# Altium project 397881-L.PrjPcb
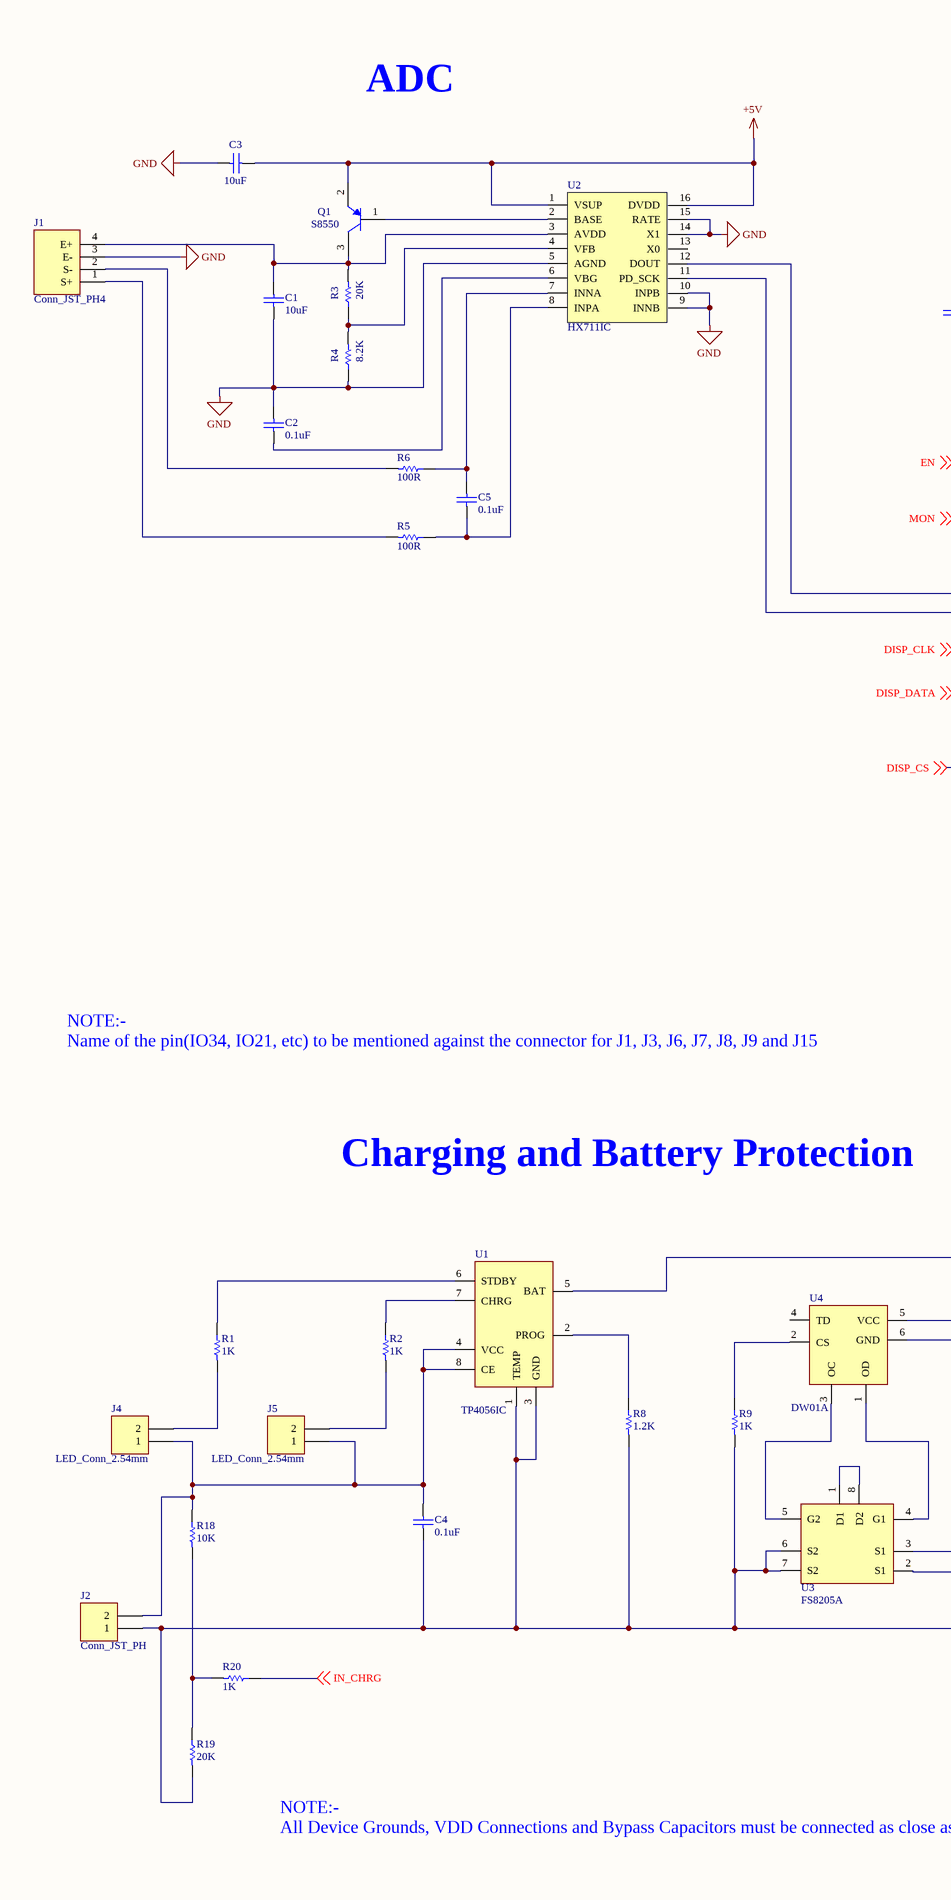
[diagram p0: 397881-L.SchDoc, left]
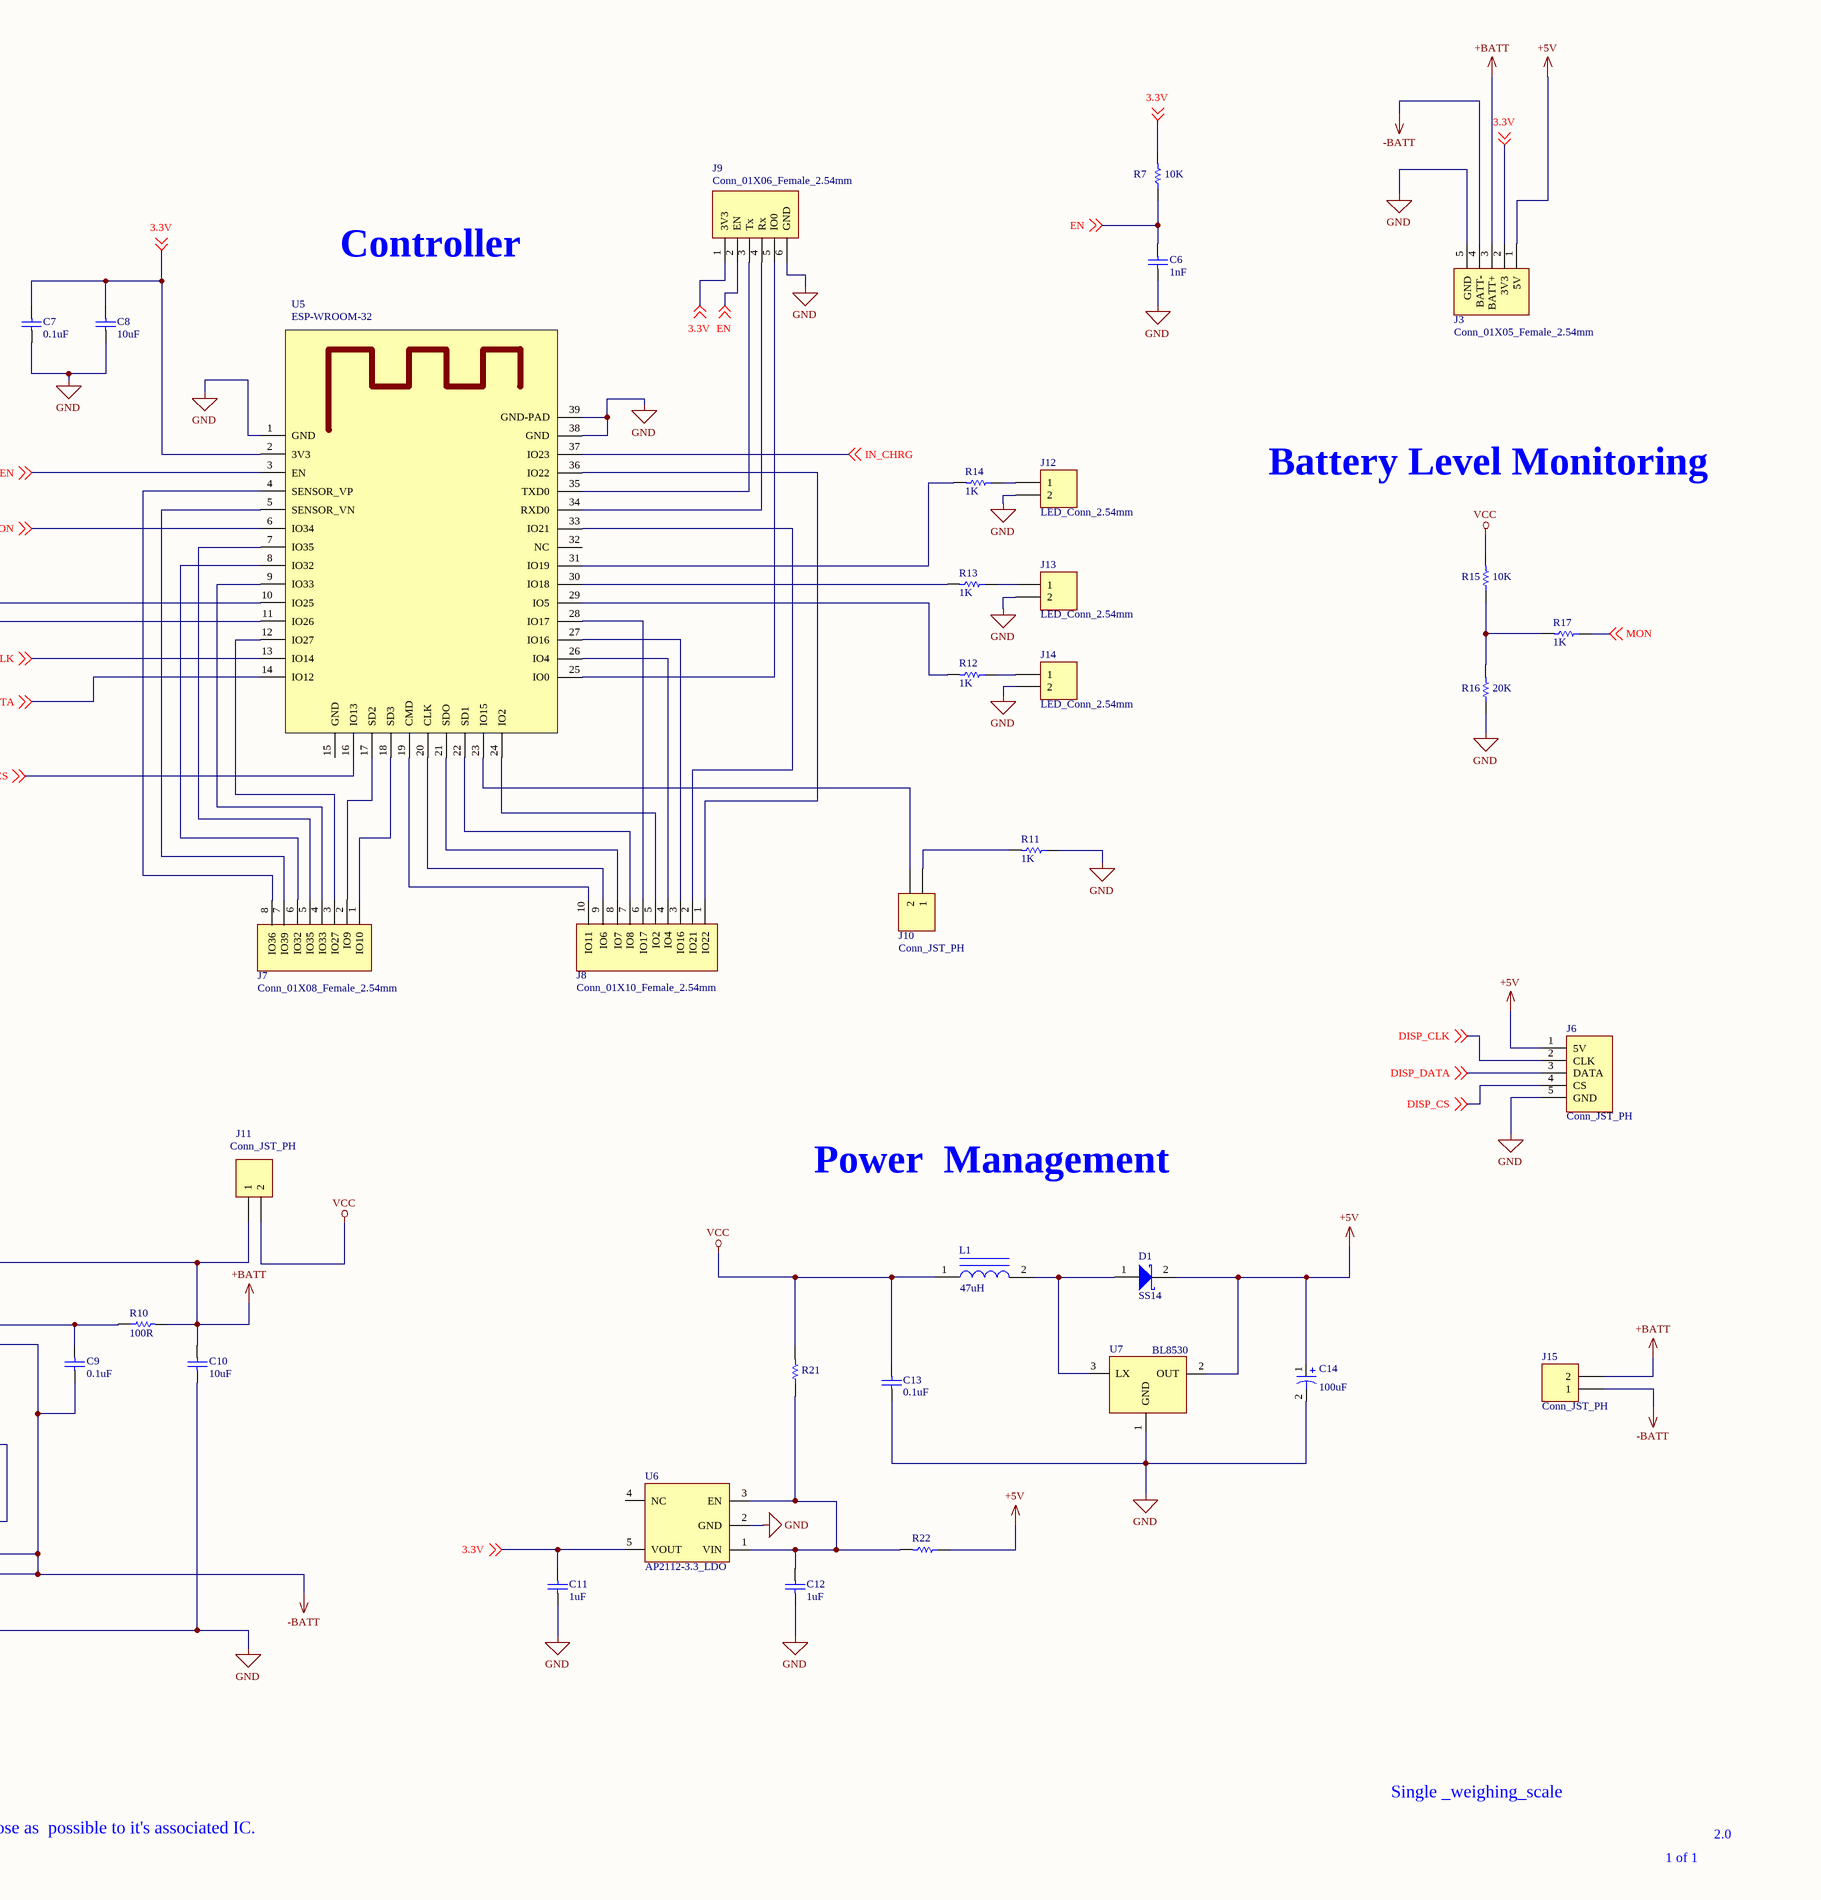
[diagram p1: 397881-L.SchDoc, right]
1 sheet, 61 parts. Net scope: global (net labels, ports and power ports of the same name join across sheets).
Board file: 397881-L.PcbDoc

## Sheet 397881-L.SchDoc
size A2

### Parts
C1  value 10uF  [C0603]  (hidden comment: Cap)
C2  value 0.1uF  [C0603]  (hidden comment: Cap)
C3  value 10uF  [C0603]  (hidden comment: Cap)
C4  value 0.1uF  [C0603]  (hidden comment: Cap)
C5  value 0.1uF  [C0603]  (hidden comment: Cap)
C6  value 1nF  [C0603]  (hidden comment: Cap)
C7  value 0.1uF  [C0603]  (hidden comment: Cap)
C8  value 10uF  [C0603]  (hidden comment: Cap)
C9  value 0.1uF  [C0603]  (hidden comment: Cap)
C10  value 10uF  [C0603]  (hidden comment: Cap)
C11  value 1uF  [C0603]  (hidden comment: Cap)
C12  value 1uF  [C0603]  (hidden comment: Cap)
C13  value 0.1uF  [C0603]  (hidden comment: Cap)
C14  value 100uF  [C14]  (hidden comment: Cap Pol1)
D1  SS14  [D1]
J1  Conn_JST_PH4  [J1]
J2  Conn_JST_PH  [J2,J10,J11,J15]
J3  Conn_01X05_Female_2.54mm  [J3]
J4  LED_Conn_2.54mm  [J4,J5,J12,J13,J14]
J5  LED_Conn_2.54mm  [J4,J5,J12,J13,J14]
J6  Conn_JST_PH  [J6]
J7  Conn_01X08_Female_2.54mm  [J7]
J8  Conn_01X10_Female_2.54mm  [J8]
J9  Conn_01X06_Female_2.54mm  [J9]
J10  Conn_JST_PH  [J2,J10,J11,J15]
J11  Conn_JST_PH  [J2,J10,J11,J15]
J12  LED_Conn_2.54mm  [J4,J5,J12,J13,J14]
J13  LED_Conn_2.54mm  [J4,J5,J12,J13,J14]
J14  LED_Conn_2.54mm  [J4,J5,J12,J13,J14]
J15  Conn_JST_PH  [J2,J10,J11,J15]
L1  value 47uH  [L1]  (hidden comment: Inductor Iron)
Q1  S8550  [Q1]
R1  value 1K  [R0603]  (hidden comment: Res1)
R2  value 1K  [R0603]  (hidden comment: Res1)
R3  value 20K  [R0603]  (hidden comment: Res1)
R4  value 8.2K  [R0603]  (hidden comment: Res1)
R5  value 100R  [R0603]  (hidden comment: Res1)
R6  value 100R  [R0603]  (hidden comment: Res1)
R7  value 10K  [R0603]  (hidden comment: Res1)
R8  value 1.2K  [R0603]  (hidden comment: Res1)
R9  value 1K  [R0603]  (hidden comment: Res1)
R10  value 100R  [R0603]  (hidden comment: Res1)
R11  value 1K  [R0603]  (hidden comment: Res1)
R12  value 1K  [R0603]  (hidden comment: Res1)
R13  value 1K  [R0603]  (hidden comment: Res1)
R14  value 1K  [R0603]  (hidden comment: Res1)
R15  value 10K  [R0603]  (hidden comment: Res1)
R16  value 20K  [R0603]  (hidden comment: Res1)
R17  value 1K  [R0603]  (hidden comment: Res1)
R18  value 10K  [R0603]  (hidden comment: Res1)
R19  value 20K  [R0603]  (hidden comment: Res1)
R20  value 1K  [R0603]  (hidden comment: Res1)
R21  Res1  [R0603]  (value not drawn)
R22  Res1  [R0603]  (value not drawn)
U1  TP4056IC  [U1]
U2  HX711IC
U3  FS8205A  [U3]
U4  DW01A  [U4]
U5  ESP-WROOM-32  [U5]
U6  AP2112-3.3_LDO  [U6]
U7  BL8530  [U7]

### Nets
+5V: C3.2 C14.1 D1.2(K) J3.1(5V) J6.1(5V) Q1.2(E) R22.1 U2.1(VSUP) U2.16(DVDD) U7.2(OUT)
+BATT: C10.2 J3.3(BATT+) J11.1 J15.2 R10.2 U1.5(BAT)
-BATT: C9.1 J3.4(BATT-) J15.1 U3.2(S1) U3.3(S1) U4.6(GND)
GND: C1.1 C2.2 C3.1 C4.1 C6.1 C7.1 C8.1 C10.1 C11.1 C12.1 C13.1 C14.2 J1.3(E-) J2.1 J3.5(GND) J6.5(GND) J9.6(GND) J12.2 J13.2 J14.2 R4.1 R8.2 R9.2 R11.1 R16.1 R19.2 U1.1(TEMP) U1.3(GND) U2.5(AGND) U2.9(INNB) U2.10(INPB) U2.14(X1) U2.15(RATE) U3.6(S2) U3.7(S2) U5.1(GND) U5.38(GND) U5.39(GND-PAD) U6.2(GND) U7.1(GND)
VCC: C13.2 J11.2 L1.1 R15.2 R21.2
3.3V: C7.2 C8.2 C11.2 J3.2(3V3) J9.1(3V3) R7.2 U5.2(3V3) U6.5(VOUT) ; off-sheet 3.3V
DISP_CLK: J6.2(CLK) U5.13(IO14) ; off-sheet DISP_CLK
DISP_CS: J6.4(CS) U5.16(IO13) ; off-sheet DISP_CS
DISP_DATA: J6.3(DATA) U5.14(IO12) ; off-sheet DISP_DATA
EN: C6.2 J9.2(EN) R7.1 U5.3(EN) ; off-sheet EN
IN_CHRG: R20.1 U5.37(IO23) ; off-sheet IN_CHRG
MON: R17.1 U5.6(IO34) ; off-sheet MON
NetC1_2: C1.2 J1.4(E+) Q1.3(C) R3.2 U2.3(AVDD)
NetC2_1: C2.1 U2.6(VBG)
NetC4_2: C4.2 J2.2 J4.1 J5.1 R18.1 U1.4(VCC) U1.8(CE)
NetC5_1: C5.1 R5.1 U2.8(INPA)
NetC5_2: C5.2 R6.1 U2.7(INNA)
NetC9_2: C9.2 R10.1 U4.5(VCC)
NetC12_2: C12.2 R21.1 R22.2 U6.1(VIN) U6.3(EN)
NetD1_1: D1.1(A) L1.2 U7.3(LX)
NetJ1_1: J1.1(S+) R5.2
NetJ1_2: J1.2(S-) R6.2
NetJ4_2: J4.2 R1.2
NetJ5_2: J5.2 R2.2
NetJ7_1: J7.1(IO10) U5.18(SD3)
NetJ7_2: J7.2(IO9) U5.17(SD2)
NetJ7_3: J7.3(IO27) U5.12(IO27)
NetJ7_4: J7.4(IO33) U5.9(IO33)
NetJ7_5: J7.5(IO35) U5.7(IO35)
NetJ7_6: J7.6(IO32) U5.8(IO32)
NetJ7_7: J7.7(IO39) U5.5(SENSOR_VN)
NetJ7_8: J7.8(IO36) U5.4(SENSOR_VP)
NetJ8_1: J8.1(IO22) U5.36(IO22)
NetJ8_2: J8.2(IO21) U5.33(IO21)
NetJ8_3: J8.3(IO16) U5.27(IO16)
NetJ8_4: J8.4(IO4) U5.26(IO4)
NetJ8_5: J8.5(IO2) U5.24(IO2)
NetJ8_6: J8.6(IO17) U5.28(IO17)
NetJ8_7: J8.7(IO8) U5.22(SD1)
NetJ8_8: J8.8(IO7) U5.21(SDO)
NetJ8_9: J8.9(IO6) U5.20(CLK)
NetJ8_10: J8.10(IO11) U5.19(CMD)
NetJ9_3: J9.3(Tx) U5.35(TXD0)
NetJ9_4: J9.4(Rx) U5.34(RXD0)
NetJ9_5: J9.5(IO0) U5.25(IO0)
NetJ10_1: J10.1 R11.2
NetJ10_2: J10.2 U5.23(IO15)
NetJ12_1: J12.1 R14.1
NetJ13_1: J13.1 R13.1
NetJ14_1: J14.1 R12.1
NetQ1_1: Q1.1(B) U2.2(BASE)
NetR1_1: R1.1 U1.6(STDBY)
NetR2_1: R2.1 U1.7(CHRG)
NetR3_1: R3.1 R4.2 U2.4(VFB)
NetR8_1: R8.1 U1.2(PROG)
NetR9_1: R9.1 U4.2(CS)
NetR12_2: R12.2 U5.29(IO5)
NetR13_2: R13.2 U5.30(IO18)
NetR14_2: R14.2 U5.31(IO19)
NetR15_1: R15.1 R16.2 R17.2
NetR18_2: R18.2 R19.1 R20.2
NetU2_11: U2.11(PD_SCK) U5.11(IO26)
NetU2_12: U2.12(DOUT) U5.10(IO25)
NetU3_1: U3.1(D1) U3.8(D2)
NetU3_4: U3.4(G1) U4.1(OD)
NetU3_5: U3.5(G2) U4.3(OC)

Not connected (* = marked no-connect by the designer): U2 13(X0); U4 4(TD); U5 15(GND) 32(NC); U6 4(NC)

### Notes on the sheet
- ADC
- Controller
- Battery Level Monitoring
- NOTE:-
- Name of the pin(IO34, IO21, etc) to be mentioned against the connector for J1, J3, J6, J7, J8, J9 and J15
- Charging and Battery Protection
- Power  Management
- Single _weighing_scale
- All Device Grounds, VDD Connections and Bypass Capacitors must be connected as close as  possible to it's associated IC.
- 1 of 1
- 2.0

### Library data of the parts
C1-C13 = Cap: Capacitor; Published: 8-Jun-2000; LatestRevisionDate: 17-Jul-2002; LatestRevisionNote: Re-released for DXP Platform.; PackageReference: RAD-0.3; Publisher: Altium Limited; PackageDescription: Radial Cap, Thru-Hole; 2 Leads; 0.3 in Pin Spacing
C14 = Cap Pol1: Polarized Capacitor (Radial); Published: 8-Jun-2000; LatestRevisionDate: 17-Jul-2002; LatestRevisionNote: Re-released for DXP Platform.; PackageReference: RB7.6-15; Publisher: Altium Limited; PackageDescription: Polarized Capacitor (Radial); 2 Leads
D1 = D Schottky: Schottky Diode; Published: 8-Jun-2000; LatestRevisionDate: 17-Jul-2002; LatestRevisionNote: Re-released for DXP Platform.; PackageReference: SMB; Publisher: Altium Limited; PackageDescription: DO-214-AA/SMB; 2 C-Bend Leads; Body 5.3 x 3.6 mm, inc. leads (LxW); Code_JEDEC: DO-214-AA
J1 = Conn_JST_PH4: Header, 5-Pin; LatestRevisionDate: 17-Jul-2002; LatestRevisionNote: Re-released for DXP Platform.; Publisher: Altium Limited
J2 J4 J5 J10-J15 = Header 2: Header, 2-Pin; LatestRevisionDate: 17-Jul-2002; LatestRevisionNote: Re-released for DXP Platform.; Publisher: Altium Limited
J3 = Conn_01X05_Female_2.54mm: Header, 6-Pin; LatestRevisionDate: 17-Jul-2002; LatestRevisionNote: Re-released for DXP Platform.; Publisher: Altium Limited
J6 = Conn_JST_PH: Header, 5-Pin; LatestRevisionDate: 17-Jul-2002; LatestRevisionNote: Re-released for DXP Platform.; Publisher: Altium Limited
J7 = Conn_01X08_Female_2.54mm: Header, 6-Pin; LatestRevisionDate: 17-Jul-2002; LatestRevisionNote: Re-released for DXP Platform.; Publisher: Altium Limited
J8 = Conn_01X10_Female_2.54mm: Header, 6-Pin; LatestRevisionDate: 17-Jul-2002; LatestRevisionNote: Re-released for DXP Platform.; Publisher: Altium Limited
J9 = Conn_01X06_Female_2.54mm: Header, 6-Pin; LatestRevisionDate: 17-Jul-2002; LatestRevisionNote: Re-released for DXP Platform.; Publisher: Altium Limited
L1 = Inductor Iron: Magnetic-Core Inductor; Published: 24-Mar-1999; LatestRevisionDate: 17-Jul-2002; LatestRevisionNote: Re-released for DXP Platform.; PackageReference: AXIAL-0.9; Publisher: Altium Limited; PackageDescription: Axial Device, Thru-Hole; 2 Leads; 0.9 in Pin Spacing
Q1 = PNP: PNP Bipolar Transistor; Published: 8-Jun-2000; LatestRevisionDate: 29-May-2009; LatestRevisionNote: IPC-7351 Footprint Added.; PackageVersion: Aug-1999; PackageReference: SOT-23B; Publisher: Altium Limited; PackageDescription: 3-Pin SOT-23 Package 0.95 mm Pitch, 2.4 mm Lead Span
R1-R20 = Res1: Resistor; Published: 8-Jun-2000; LatestRevisionDate: 17-Jul-2002; LatestRevisionNote: Re-released for DXP Platform.; PackageReference: AXIAL-0.3; Publisher: Altium Limited; PackageDescription: Axial Device, Thru-Hole; 2 Leads; 0.3 in Pin Spacing
R21 R22 = Res1: Resistor; Value: 100R; Published: 8-Jun-2000; LatestRevisionDate: 17-Jul-2002; LatestRevisionNote: Re-released for DXP Platform.; PackageReference: AXIAL-0.3; Publisher: Altium Limited; PackageDescription: Axial Device, Thru-Hole; 2 Leads; 0.3 in Pin Spacing